# Altium schematic sheet Sensor.SchDoc: LUNA_Sensor
size A; Author: Mert Ali Cakici; DrawnBy: Mert Ali Cakici; Revision: 0.1; SheetNumber: 3; SheetTotal: 3
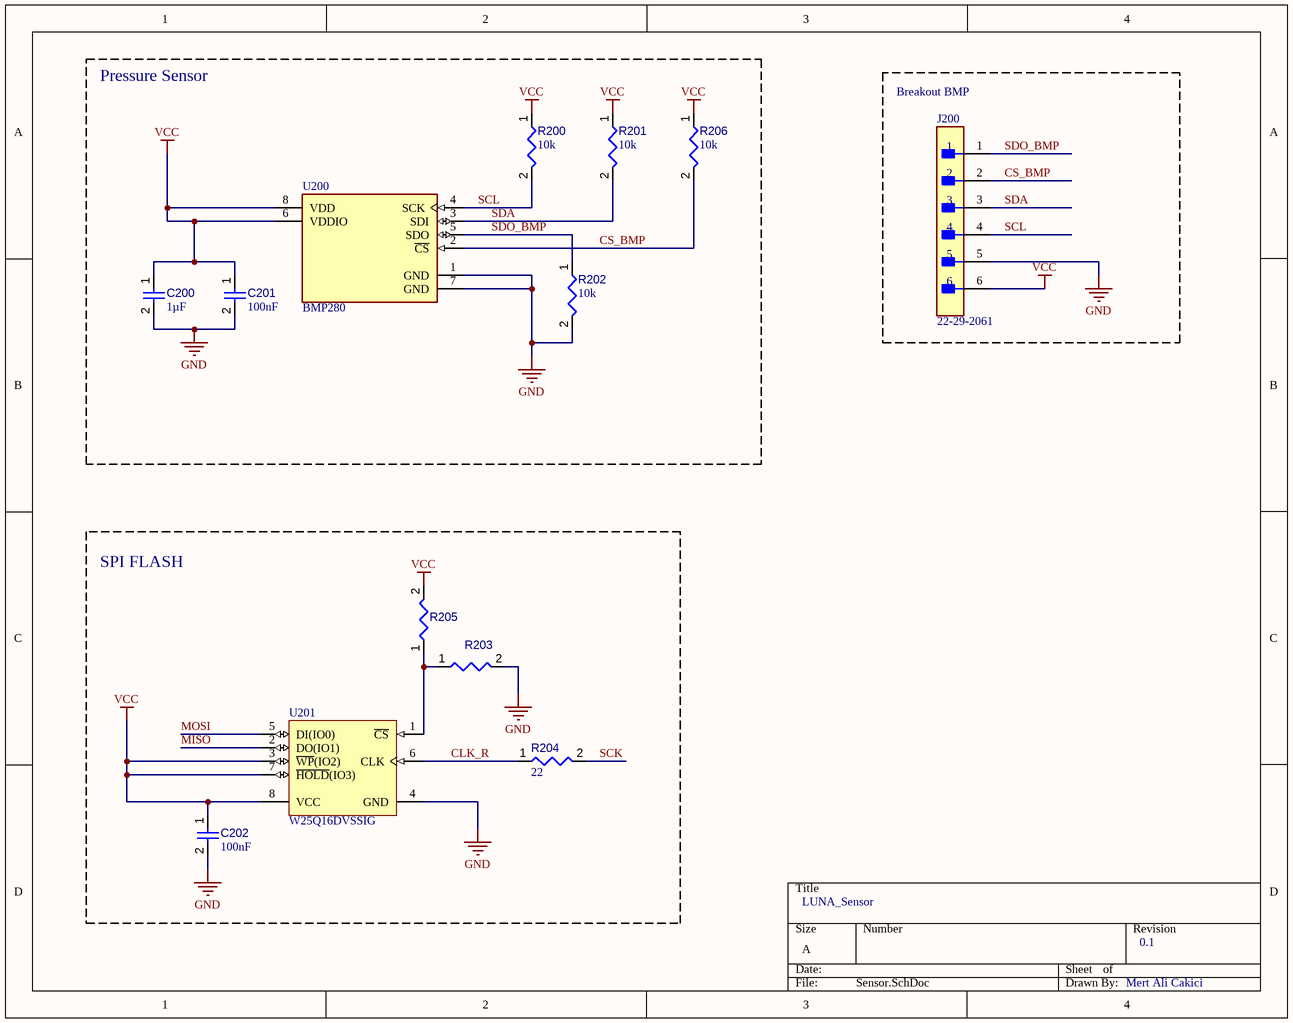
[diagram p0: Sensor.SchDoc]

## Parts
C200  value 1µF  [CAPC1608X90X35NL15T15]  (hidden comment: Capacitor 1uF +/- 10% 16V 0603)
C201  value 100nF  [CAPC1608X90X40NL10T20]  (hidden comment: Capacitor 100 nF +/-10% 50 V 0603)
C202  value 100nF  [CAPC1608X90X40NL10T20]  (hidden comment: Capacitor 100 nF +/-10% 50 V 0603)
J200  22-29-2061  [FP-22-29-2061-MFG]
R200  value 10k  [RESC1608X55X25NL10T15]  (hidden comment: Resistor 10k +/-1% 0603 100 mW)
R201  value 10k  [RESC1608X55X25NL10T15]  (hidden comment: Resistor 10k +/-1% 0603 100 mW)
R202  value 10k  [RESC1608X55X25NL10T15]  (hidden comment: Resistor 10k +/-1% 0603 100 mW)
R203  Jumper 0603  [RESC0603(1608)_L]  (value not drawn)
R204  value 22  [RESC1609X50X30ML08T20]  (hidden comment: Resistor 22R +/-1% 0603 100 mW)
R205  DNP  [RESC0603(1608)_L]  (value not drawn)
R206  value 10k  [RESC1608X55X25NL10T15]  (hidden comment: Resistor 10k +/-1% 0603 100 mW)
U200  BMP280  [FP-BMP280-MFG]
U201  W25Q16DVSSIG  [WINB-W25Q16DVSSIG-8_N]

## Blocks framed on the sheet
Pressure Sensor: C200 C201 R200-R202 R206 U200
Breakout BMP: J200
SPI FLASH: C202 R203-R205 U201

## Nets
GND: C200.2 C201.2 C202.2 J200.5 R202.2 R203.2 U200.1(GND) U200.7(GND) U201.4(GND)
VCC: C200.1 C201.1 C202.1 J200.6 R200.1 R201.1 R205.2 R206.1 U200.6(VDDIO) U200.8(VDD) U201.3(~{WP}(IO2)) U201.7(~{HOLD}(IO3)) U201.8(VCC)
CLK_R: R204.1 U201.6(CLK)
CS_BMP: J200.2 R206.2 U200.2(~{CS})
MISO: U201.2(DO(IO1))
MOSI: U201.5(DI(IO0))
SCK: R204.2
SCL: J200.4 R200.2 U200.4(SCK)
SDA: J200.3 R201.2 U200.3(SDI)
SDO_BMP: J200.1 R202.1 U200.5(SDO)
NetR203_1: R203.1 R205.1 U201.1(~{CS})

## Library data of the parts
C200 = CMP-001-00004-6: Chip Capacitor, 1 uF, +/- 10%, 16 V, 0603 (1608 Metric); Capacitor Type: Ceramic; Mounting Technology: SM; RoHS Compliant: True; Min Operating Temperature: -55°C; Case/Package: 0603; Pins: 2; Voltage Rating: 16V; Max Operating Temperature: 125°C; Tolerance: 10%
C201 C202 = CMP-001-00017-6: Chip Capacitor, 100 nF, +/- 10%, 50 V, 0603 (1608 Metric); Voltage Rating: 50V; Capacitor Type: Ceramic; Tolerance: 10%; Mounting Technology: SM; Max Operating Temperature: 125°C; RoHS Compliant: True; Pins: 2; Case/Package: 0603; Min Operating Temperature: -55°C
J200 = CMP-04776-000348-1: CONN HEADER VERT 6POS 2.54MM; Gender: Male; Number of Poles: 6; Voltage Rating: 250V; Insulation Resistance: 50GR; Contact Resistance: 10mR; Current Rating: 4A; Number of Lines: 1; Height: 11.7mm; Mount: Through Hole; Length: 15.24mm; Contact Plating: Gold; Contact Type: Male Pin; Contact Material: Brass; Housing Material: Nylon; Series: KK® 6410; Number of Positions: 6; Contact Mating Length: 0.295inch; Fastening Type: Friction; RoHS Compliant: Yes; Color: Natural; Max Operating Temperature: 75°C; Contact Gender: Male; Packaging: Bulk; Termination: Solder; Voltage Rating (DC): 250V; Orientation: Straight; Radiation Hardening: No; Flammability Rating: UL94 V-0; Package Quantity: 1000; Housing Color: White; Number of Rows: 1; Min Operating Temperature: 0°C; Max Current Rating: 4A; Pitch: 2.54mm; Depth: 5.8mm; Number of Contacts: 6; Lead Free: Lead Free
R200-R202 R206 = CMP-009-00017-5: Chip Resistor, 10 KOhm, +/- 1%, 01 W, -55 to 155 degC, 0603 (1608 Metric); Voltage Rating: 50V; Power: 100mW; RoHS Compliant: True; Min Operating Temperature: -55°C; Pins: 2; Case/Package: 0603; Mounting Technology: SM; Max Operating Temperature: 155°C; Tolerance: 1%
R203 = CMP-009-00175-3: Value: 0; Pins: 2; Min Operating Temperature: -55°C; Max Operating Temperature: 155°C; Case/Package: 0603
R204 = CMP-009-00027-5: Chip Resistor, 22 Ohm, +/- 1%, 100 mW, -55 to 155 degC, 0603 (1608 Metric); Power: 100mW; Voltage Rating: 75V; Max Operating Temperature: 155°C; Min Operating Temperature: -55°C; Tolerance: 1%; RoHS Compliant: True; Mounting Technology: SM; Case/Package: 0603; Pins: 2
R205 = CMP-009-00175-3: Jumper 0603; Value: 0; Pins: 2; Min Operating Temperature: -55°C; Max Operating Temperature: 155°C; Case/Package: 0603
U200 = CMP-2000-05076-3: SENSOR PRESSURE ABS; Operating Pressure: 15.95PSI; Pressure Type: Absolute; Output Type: SPI; Max Pressure: 290.08PSI; Port Style: No Port; Case/Package: SMD/SMT; Lead Free: Lead Free; Termination: SMD/SMT; Min Operating Temperature: -40°C; Number of Pins: 8; Max Operating Temperature: 85°C
U201 = CMP-2000-05434-1: IC FLASH 16MBIT 104MHZ 8SOIC; Manufacturer: Winbond; Interface Type: Serial(SPI); Rad Hardened: No; Programmable: Yes; Supply Current: 18mA; Number of Words: 2M; Density: 16777216Bit; Word Size: 8b; Sync/Async: Synchronous; Cell Type: NOR; Operating Supply Voltage (Min): 2.7V; Boot Type: Bottom/Top; Address Bus: 24b; Program/Erase Volt (Typ): 2.7to3.6V; Access Time (Max): 7ns; Operating Supply Voltage (Max): 3.6V; Operating Supply Voltage (Typ): 3/3.3V; Mounting: SurfaceMount; Datasheet Version: Rev. D, 10/2012; Manufacturer URL: http://www.winbond.com/hq/index.html?__locale=en; Operating Temperature (Min): -40C; Operating Temperature (Max): 85C; Pin Count: 8; Package Type: SOICW; Datasheet URL: https://ciiva.com/datasheet-click-14728450?src=ciiva&sig=bd4f4644; Operating Temp Range: -40Cto85C; Operating Temperature Classification: Industrial